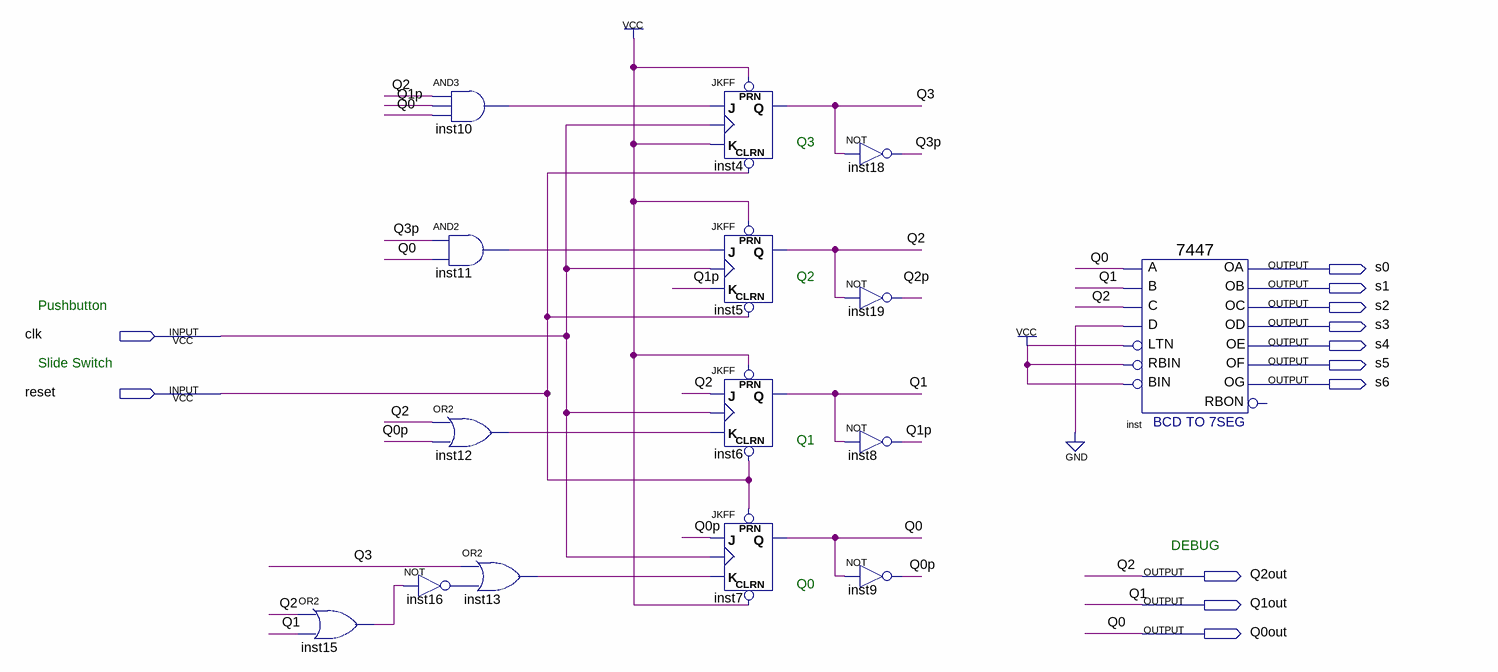
[diagram p0: schematic sheet]
// Quartus schematic SequenceCounter.bdf as structural Verilog: 15 symbols, 12 pins
module SequenceCounter (
  input  clk,
  input  reset,
  output s0,
  output s1,
  output s2,
  output s3,
  output s4,
  output s5,
  output s6,
  output Q2out,
  output Q1out,
  output Q0out
);

  wire inst10_out, inst11_out, inst12_out, inst13_out, inst15_out, inst16_out, Q0p, Q1p, Q2p, Q3, Q3p;

  or inst15 (inst15_out, Q2out, Q1out);
  and inst10 (inst10_out, Q2out, Q1p, Q0out);
  and inst11 (inst11_out, Q3p, Q0out);
  or inst12 (inst12_out, Q2out, Q0p);
  not inst16 (inst16_out, inst15_out);
  or inst13 (inst13_out, Q3, inst16_out);
  JKFF inst4 (.PRN(1'b1), .CLRN(reset), .K(1'b1), .J(inst10_out), .CLK(clk), .Q(Q3));
  JKFF inst5 (.PRN(1'b1), .CLRN(reset), .K(Q1p), .J(inst11_out), .CLK(clk), .Q(Q2out));
  JKFF inst6 (.PRN(1'b1), .CLRN(reset), .K(inst12_out), .J(Q2out), .CLK(clk), .Q(Q1out));
  JKFF inst7 (.PRN(reset), .CLRN(1'b1), .K(inst13_out), .J(Q0p), .CLK(clk), .Q(Q0out));
  not inst18 (Q3p, Q3);
  not inst19 (Q2p, Q2out);
  not inst8 (Q1p, Q1out);
  not inst9 (Q0p, Q0out);
  \7447  inst (
    .LTN(1'b1), .B(Q1out), .C(Q2out), .D(1'b0), .RBIN(1'b1), .BIN(1'b1), .A(Q0out), .OB(s1), .OC(s2),
    .OE(s4), .OD(s3), .OF(s5), .OG(s6), .OA(s0));  // open: RBON

  // Other names for the same wires on the sheet: Q0 = Q0out; Q1 = Q1out; Q2 = Q2out

  // Notes on the sheet:
  //   Q3
  //   Q2
  //   Pushbutton 
  //   Slide Switch
  //   Q1
  //   DEBUG
  //   Q0
endmodule
